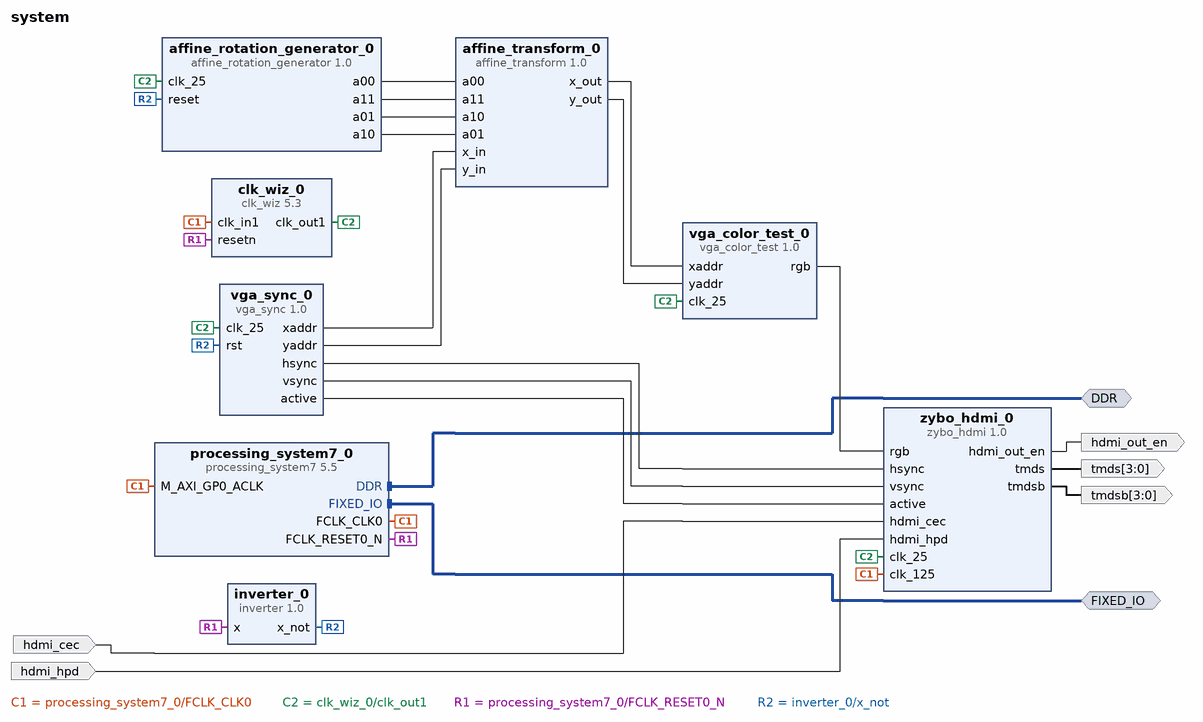
[diagram p0: block diagram of the top level]
# Vivado block design system, xc7z010clg400-1, Vivado 2016.4
create_bd_design system

create_bd_intf_port -mode Master -vlnv xilinx.com:interface:ddrx_rtl:1.0 DDR
create_bd_intf_port -mode Master -vlnv xilinx.com:display_processing_system7:fixedio_rtl:1.0 FIXED_IO
create_bd_port -dir I hdmi_cec
create_bd_port -dir I hdmi_hpd
create_bd_port -dir O -from 3 -to 0 tmds
create_bd_port -dir O -from 3 -to 0 tmdsb
create_bd_port -dir O hdmi_out_en

create_bd_cell -type ip -vlnv xilinx.com:ip:processing_system7:5.5 processing_system7_0
set_property -dict [list \
  CONFIG.PCW_UIPARAM_DDR_FREQ_MHZ 525 \
  CONFIG.PCW_CRYSTAL_PERIPHERAL_FREQMHZ 50.000000 \
  CONFIG.PCW_APU_PERIPHERAL_FREQMHZ 650 \
  CONFIG.PCW_SDIO_PERIPHERAL_FREQMHZ 50 \
  CONFIG.PCW_FPGA0_PERIPHERAL_FREQMHZ 100 \
  CONFIG.PCW_PRESET_BANK1_VOLTAGE {LVCMOS 1.8V} \
  CONFIG.PCW_UIPARAM_DDR_PARTNO {MT41K128M16 JT-125} \
  CONFIG.PCW_QSPI_PERIPHERAL_ENABLE 1 \
  CONFIG.PCW_QSPI_GRP_SINGLE_SS_ENABLE 1 \
  CONFIG.PCW_QSPI_GRP_FBCLK_ENABLE 1 \
  CONFIG.PCW_ENET0_PERIPHERAL_ENABLE 1 \
  CONFIG.PCW_ENET0_ENET0_IO {MIO 16 .. 27} \
  CONFIG.PCW_ENET0_GRP_MDIO_ENABLE 1 \
  CONFIG.PCW_SD0_PERIPHERAL_ENABLE 1 \
  CONFIG.PCW_SD0_GRP_CD_ENABLE 1 \
  CONFIG.PCW_SD0_GRP_CD_IO {MIO 47} \
  CONFIG.PCW_SD0_GRP_WP_ENABLE 1 \
  CONFIG.PCW_UART1_PERIPHERAL_ENABLE 1 \
  CONFIG.PCW_TTC0_PERIPHERAL_ENABLE 1 \
  CONFIG.PCW_USB0_PERIPHERAL_ENABLE 1 \
  CONFIG.PCW_GPIO_MIO_GPIO_ENABLE 1 \
] [get_bd_cells processing_system7_0]
# 105 more settings of processing_system7_0 are not shown: defaults, MIO pin electricals, DDR timing, and values the tool derives
create_bd_cell -type ip -vlnv xilinx.com:ip:clk_wiz:5.3 clk_wiz_0
set_property -dict [list \
  CONFIG.CLKOUT1_REQUESTED_OUT_FREQ 25 \
  CONFIG.RESET_PORT resetn \
  CONFIG.MMCM_DIVCLK_DIVIDE 1 \
  CONFIG.MMCM_CLKFBOUT_MULT_F 9.125 \
  CONFIG.MMCM_CLKOUT0_DIVIDE_F 36.500 \
  CONFIG.RESET_TYPE ACTIVE_LOW \
  CONFIG.CLKOUT1_JITTER 181.828 \
  CONFIG.CLKOUT1_PHASE_ERROR 104.359 \
] [get_bd_cells clk_wiz_0]
create_bd_cell -type ip -vlnv xilinx.com:user:vga_sync:1.0 vga_sync_0
create_bd_cell -type ip -vlnv xilinx.com:user:vga_color_test:1.0 vga_color_test_0
create_bd_cell -type ip -vlnv xilinx.com:user:zybo_hdmi:1.0 zybo_hdmi_0
create_bd_cell -type ip -vlnv user.org:user:inverter:1.0 inverter_0
create_bd_cell -type ip -vlnv xilinx.com:user:affine_transform:1.0 affine_transform_0
create_bd_cell -type ip -vlnv xilinx.com:user:affine_rotation_generator:1.0 affine_rotation_generator_0

# ---- connections ----

connect_bd_intf_net [get_bd_intf_ports DDR] [get_bd_intf_pins processing_system7_0/DDR]
connect_bd_intf_net [get_bd_intf_ports FIXED_IO] [get_bd_intf_pins processing_system7_0/FIXED_IO]
connect_bd_net [get_bd_pins processing_system7_0/FCLK_CLK0] \
  [get_bd_pins clk_wiz_0/clk_in1] [get_bd_pins zybo_hdmi_0/clk_125] [get_bd_pins processing_system7_0/M_AXI_GP0_ACLK]
connect_bd_net [get_bd_pins clk_wiz_0/clk_out1] \
  [get_bd_pins vga_sync_0/clk_25] [get_bd_pins vga_color_test_0/clk_25] [get_bd_pins zybo_hdmi_0/clk_25] \
  [get_bd_pins affine_rotation_generator_0/clk_25]
connect_bd_net [get_bd_pins vga_sync_0/hsync] [get_bd_pins zybo_hdmi_0/hsync]
connect_bd_net [get_bd_pins vga_sync_0/vsync] [get_bd_pins zybo_hdmi_0/vsync]
connect_bd_net [get_bd_pins vga_sync_0/active] [get_bd_pins zybo_hdmi_0/active]
connect_bd_net [get_bd_pins vga_color_test_0/rgb] [get_bd_pins zybo_hdmi_0/rgb]
connect_bd_net [get_bd_ports hdmi_cec] [get_bd_pins zybo_hdmi_0/hdmi_cec]
connect_bd_net [get_bd_ports hdmi_hpd] [get_bd_pins zybo_hdmi_0/hdmi_hpd]
connect_bd_net [get_bd_pins zybo_hdmi_0/tmds] [get_bd_ports tmds]
connect_bd_net [get_bd_pins zybo_hdmi_0/tmdsb] [get_bd_ports tmdsb]
connect_bd_net [get_bd_pins zybo_hdmi_0/hdmi_out_en] [get_bd_ports hdmi_out_en]
connect_bd_net [get_bd_pins processing_system7_0/FCLK_RESET0_N] [get_bd_pins clk_wiz_0/resetn] [get_bd_pins inverter_0/x]
connect_bd_net -net VDDMinus [get_bd_pins inverter_0/x_not] [get_bd_pins vga_sync_0/rst] [get_bd_pins affine_rotation_generator_0/reset]
connect_bd_net [get_bd_pins affine_transform_0/x_out] [get_bd_pins vga_color_test_0/xaddr]
connect_bd_net [get_bd_pins affine_transform_0/y_out] [get_bd_pins vga_color_test_0/yaddr]
connect_bd_net [get_bd_pins vga_sync_0/xaddr] [get_bd_pins affine_transform_0/x_in]
connect_bd_net [get_bd_pins vga_sync_0/yaddr] [get_bd_pins affine_transform_0/y_in]
connect_bd_net [get_bd_pins affine_rotation_generator_0/a00] [get_bd_pins affine_transform_0/a00]
connect_bd_net [get_bd_pins affine_rotation_generator_0/a11] [get_bd_pins affine_transform_0/a11]
connect_bd_net [get_bd_pins affine_rotation_generator_0/a01] [get_bd_pins affine_transform_0/a10]
connect_bd_net [get_bd_pins affine_rotation_generator_0/a10] [get_bd_pins affine_transform_0/a01]

validate_bd_design
save_bd_design
